# EAGLE design motor_driver (EAGLE 7.1.0)
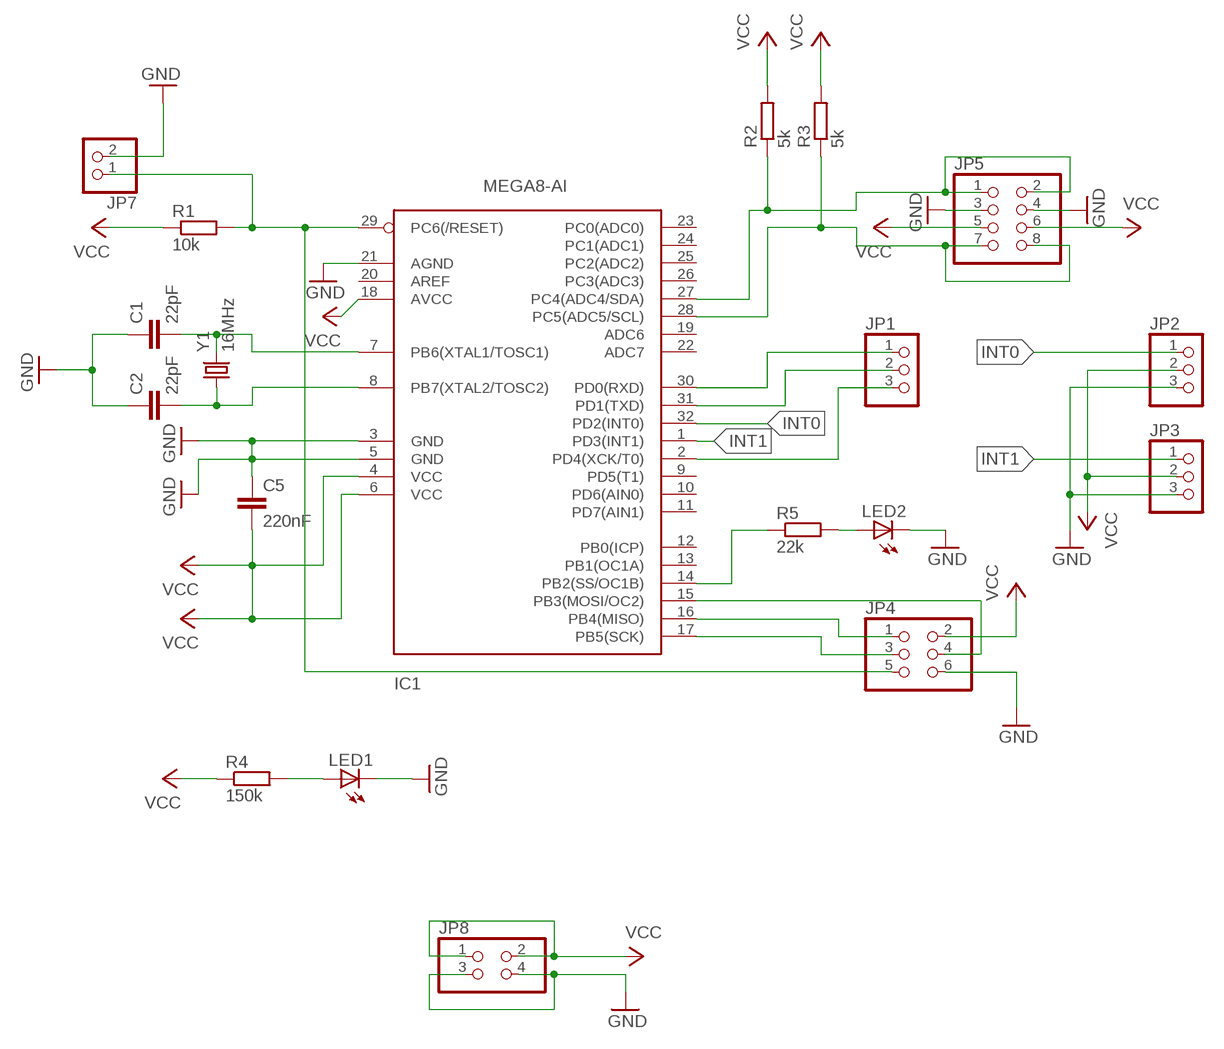
[diagram p0: schematic, sheet 1]

## Parts
C1  22pF  CAP1206  [1206]
C2  22pF  CAP1206  [1206]
C5  220nF  CAP0805  [0805]
IC1  MEGA8-AI  [TQFP32-08]
JP1  PINHD-1X3  [1X03]
JP2  PINHD-1X3  [1X03]
JP3  PINHD-1X3  [1X03]
JP4  PINHD-2X3  [2X03]
JP5  PINHD-2X4  [2X04]
JP7  PINHD-1X2  [1X02]
JP8  PINHD-2X2  [2X02]
LED1  LEDCHIPLED_0805  [CHIPLED_0805]
LED2  LEDCHIPLED_0805  [CHIPLED_0805]
R1  10k  RR1206  [R1206]
R2  5k  RR1206  [R1206]
R3  5k  RR1206  [R1206]
R4  150k  R  [R0805]
R5  22k  R  [R0805]
Y1  16MHz  CRYSTALSMD  [HC49UP]

## Nets
GND: C1.1 C2.1 C5.1 IC1.3(GND) IC1.5(GND) IC1.21(AGND) JP2.3 JP3.3 JP4.6 JP5.3 JP5.4 JP7.2 JP8.3 JP8.4 LED1.C LED2.C
INT0: IC1.32(PD2(INT0)) JP2.1
INT1: IC1.1(PD3(INT1)) JP3.1
N$1: IC1.31(PD1(TXD)) JP1.2
N$2: C2.2 IC1.8(PB7(XTAL2/TOSC2)) Y1.1
N$3: C1.2 IC1.7(PB6(XTAL1/TOSC1)) Y1.2
N$4: IC1.14(PB2(SS/OC1B)) R5.1
N$5: IC1.30(PD0(RXD)) JP1.1
N$6: IC1.2(PD4(XCK/T0)) JP1.3
N$7: IC1.15(PB3(MOSI/OC2)) JP4.4
N$9: IC1.28(PC5(ADC5/SCL)) JP5.7 JP5.8 R3.1
N$10: IC1.27(PC4(ADC4/SDA)) JP5.1 JP5.2 R2.1
N$11: LED1.A R4.2
N$12: IC1.17(PB5(SCK)) JP4.3
N$13: IC1.16(PB4(MISO)) JP4.1
N$14: LED2.A R5.2
RESET: IC1.29(PC6(/RESET)) JP4.5 JP7.1 R1.2
VCC: C5.2 IC1.4(VCC) IC1.6(VCC) IC1.18(AVCC) JP2.2 JP3.2 JP4.2 JP5.5 JP5.6 JP8.1 JP8.2 R1.1 R2.2 R3.2 R4.1
Unconnected: IC1.9(PD5(T1)) IC1.10(PD6(AIN0)) IC1.11(PD7(AIN1)) IC1.12(PB0(ICP)) IC1.13(PB1(OC1A)) IC1.19(ADC6) IC1.20(AREF) IC1.22(ADC7) IC1.23(PC0(ADC0)) IC1.24(PC1(ADC1)) IC1.25(PC2(ADC2)) IC1.26(PC3(ADC3))

## Library data of the parts
C1 C2 C5 = SparkFun-Capacitors:CAP: Capacitor Standard 0603 ceramic capacitor, and 0.1" leaded capacitor.
IC1 = avr-7:MEGA8: MICROCONTROLLER 8 Kbytes FLASH 1 kbytes SRAM 512 bytes EEPROM USART 6-channel 10 bit ADC 2-channel 8 bit ADC
JP1-JP3 = pinhead:PINHD-1X3: PIN HEADER
JP4 = pinhead:PINHD-2X3: PIN HEADER
JP5 = pinhead:PINHD-2X4: PIN HEADER
JP7 = pinhead:PINHD-1X2: PIN HEADER
JP8 = pinhead:PINHD-2X2: PIN HEADER
LED1 LED2 = adafruit:LED: LED OSRAM: - CHIPLED LG R971, LG N971, LY N971, LG Q971, LY Q971, LO R971, LY R971 LH N974, LH R974 LS Q976, LO Q976, LY Q976 LO Q996 - Hyper CHIPLED LW Q18S LB Q993, LB Q99A, LB R99A - SideLED LS A670, LO A670, LY A670, LG A670, LP A670 LB A673, LV A673, LT A673, LW A673 LH A674 LY A675 LS A676, LA A676, LO A676, LY A676, LW A676 LS A679, LY A679, LG A679 - Hyper Micro SIDELED® LS Y876, LA Y876, LO Y876, LY Y876 LT Y87S - SmartLED LW L88C, LW L88S LB L89C, LB L89S, LG L890 LS L89K, LO L89K, LY L89K LS L896, LA L896, LO L896, LY L896 - TOPLED LS T670, LO T670, LY T670, LG T670, LP T670 LSG T670, LSP T670, LSY T670, LOP T670, LYG T670 LG T671, LOG T671, LSG T671 LB T673, LV T673, LT T673, LW T673 LH T674 LS T676, LA T676, LO T676, LY T676, LB T676, LH T676, LSB T676, LW T676 LB T67C, LV T67C, LT T67C, LS T67K, LO T67K, LY T67K, LW E67C LS E67B, LA E67B, LO E67B, LY E67B, LB E67C, LV E67C, LT E67C LW T67C LS T679, LY T679, LG T679 LS T770, LO T770, LY T770, LG T770, LP T770 LB T773, LV T773, LT T773, LW T773 LH T774 LS E675, LA E675, LY E675, LS T675 LS T776, LA T776, LO T776, LY T776, LB T776 LHGB T686 LT T68C, LB T68C - Hyper Mini TOPLED® LB M676 - Mini TOPLED Santana® LG M470 LS M47K, LO M47K, LY M47K Source: http://www.osram.convergy.de/
R1-R5 = eagle-ltspice:R: RESISTOR, European symbol; SPICEMODEL: NONE; SPICEPREFIX: R
Y1 = SparkFun-FreqCtrl:CRYSTAL: Various standard crystals. Proven footprints.

## Board
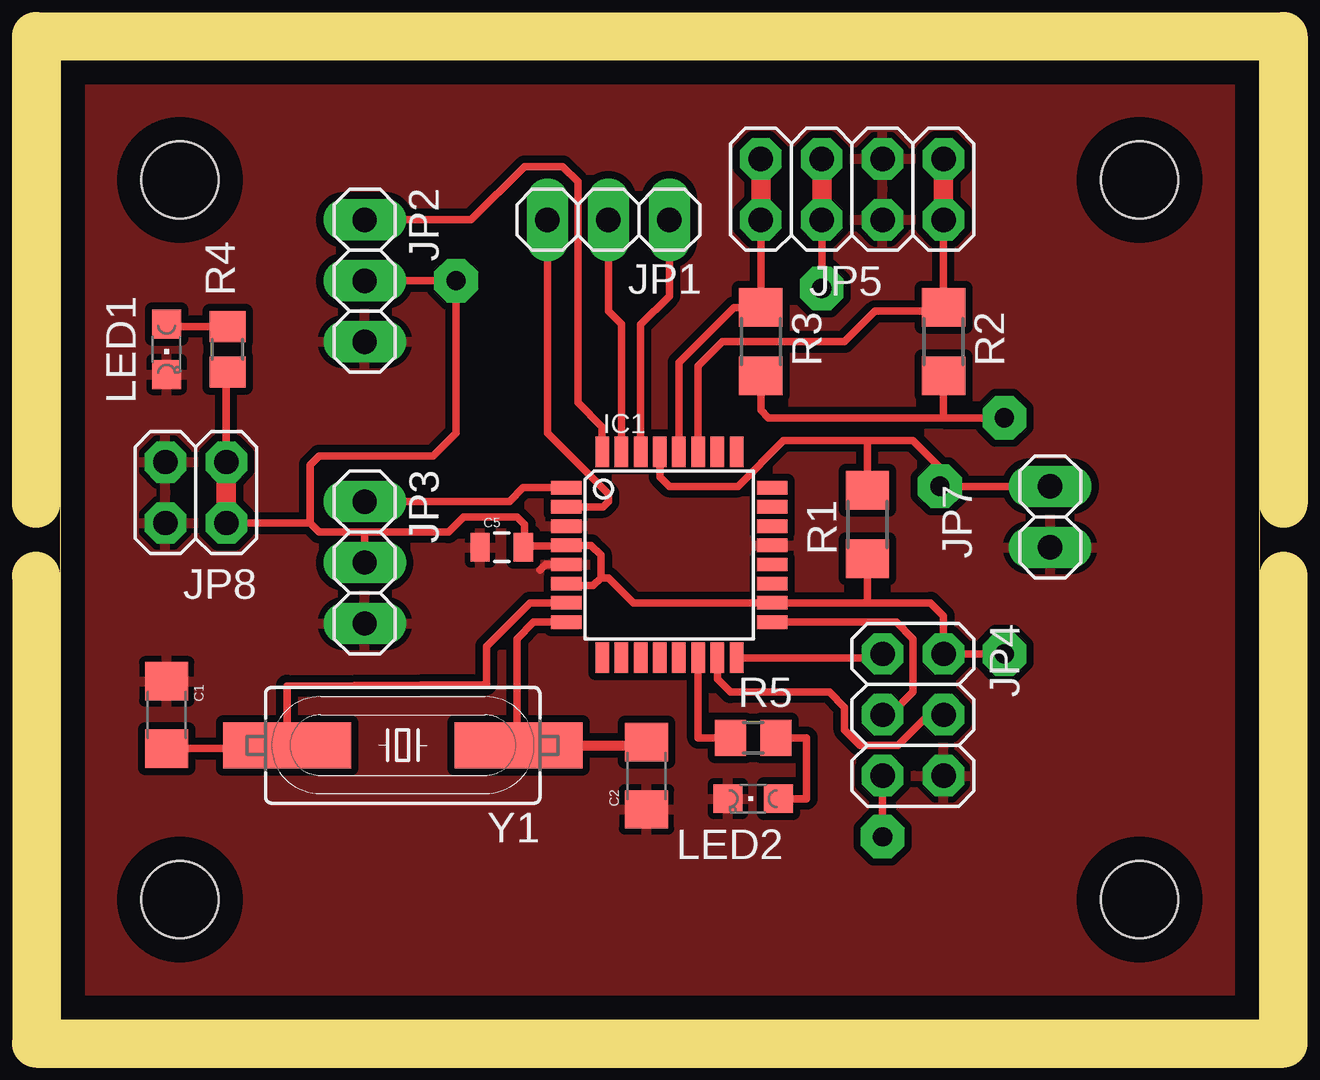
[diagram p1: board, top side]
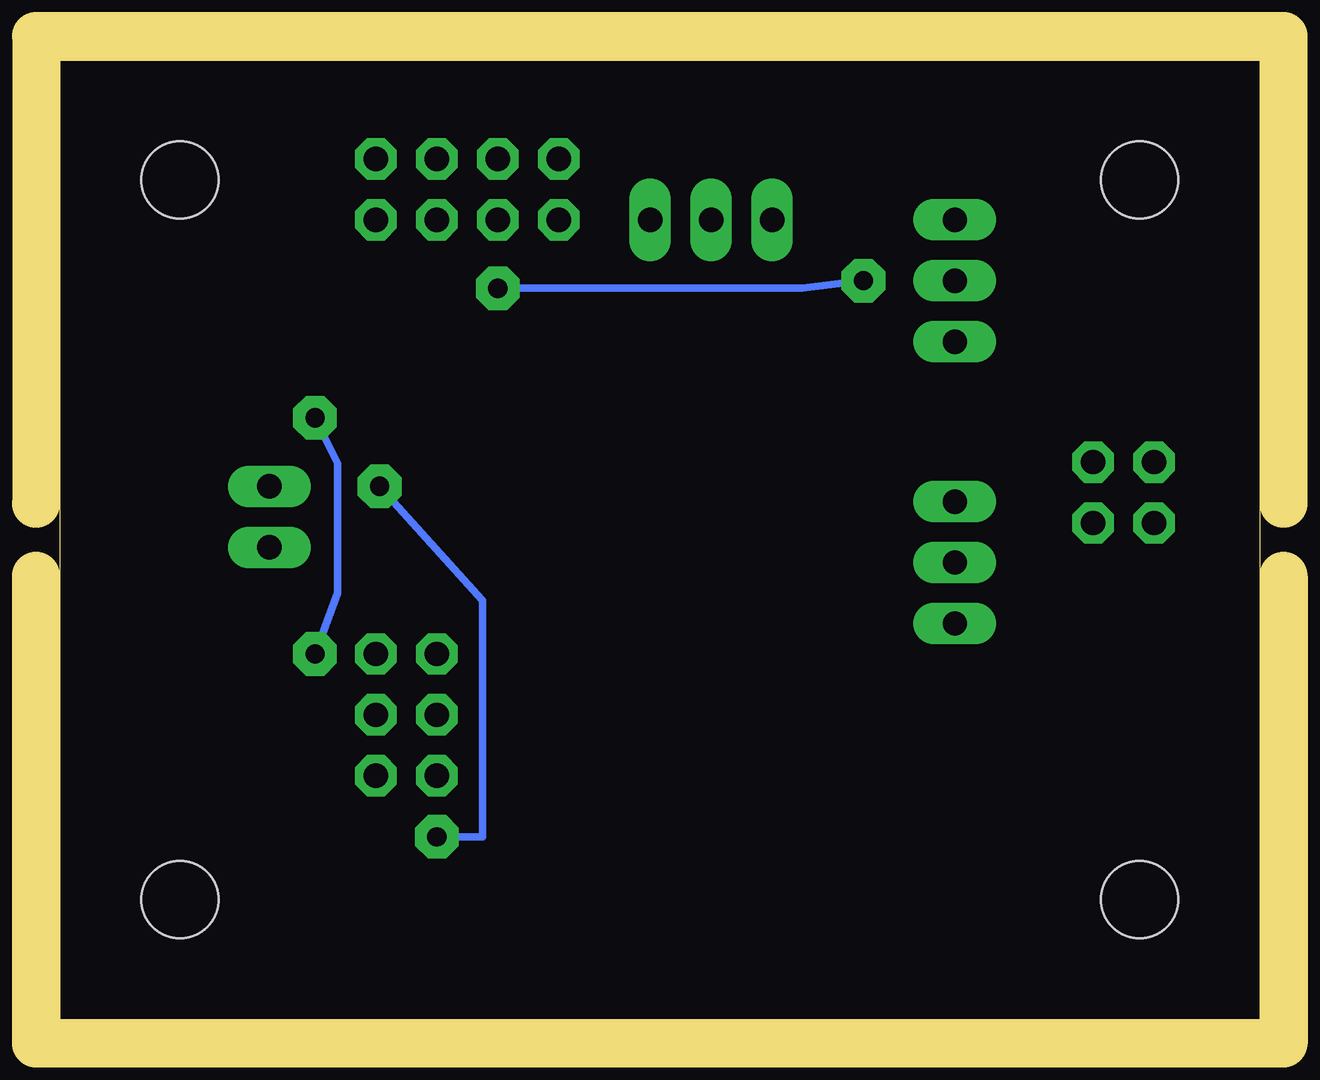
[diagram p2: board, bottom side, seen from below]

Size 50 x 40 mm. Coordinates in mm from the lower left corner, seen from the top.
Outline: 0,0 50,0 50,40 0,40 0,0
Copper layers (1*16): Top 0.035mm / dielectric 1.5mm / Bottom 0.035mm
Design rules "default *": minimum track width 10mil, minimum drill 24mil, track to track 12mil, track to pad 8mil, pad to pad 8mil, via to via 8mil, smd to smd 8mil, copper to edge 40mil, drill to drill 8mil, minimum pad ring 10mil, minimum via ring 8mil, stop-mask expansion 4mil, vias tented up to drill 0mil, thermal gap 10mil
Holes 3.2 mm at 5,35 5,5 45,5 45,35
Milling: 6 lines

### Footprints (pad centres in the part's own frame; a part is rotated, then mirrored left to right if it is on the bottom)
1206 = smd 1.6 x 1.8: 1 -1.4,0; 2 1.4,0
0805 = smd 0.8 x 1.2: 1 -0.9,0; 2 0.9,0
TQFP32-08 = smd 1.27 x 0.559: 1 -4.293,2.8; 2 -4.293,2; 3 -4.293,1.2; 4 -4.293,0.4; 5 -4.293,-0.4; 6 -4.293,-1.2; 7 -4.293,-2; 8 -4.293,-2.8; 17 4.293,-2.8; 18 4.293,-2; 19 4.293,-1.2; 20 4.293,-0.4; 21 4.293,0.4; 22 4.293,1.2; 23 4.293,2; 24 4.293,2.8 | smd 0.559 x 1.27: 9 -2.8,-4.293; 10 -2,-4.293; 11 -1.2,-4.293; 12 -0.4,-4.293; 13 0.4,-4.293; 14 1.2,-4.293; 15 2,-4.293; 16 2.8,-4.293; 25 2.8,4.293; 26 2,4.293; 27 1.2,4.293; 28 0.4,4.293; 29 -0.4,4.293; 30 -1.2,4.293; 31 -2,4.293; 32 -2.8,4.293
1X03 = drill 1.016 long: 1 -2.54,0; 2 0,0; 3 2.54,0
2X03 = drill 1.016 octagon: 1 -2.54,-1.27; 2 -2.54,1.27; 3 0,-1.27; 4 0,1.27; 5 2.54,-1.27; 6 2.54,1.27
2X04 = drill 1.016 octagon: 1 -3.81,-1.27; 2 -3.81,1.27; 3 -1.27,-1.27; 4 -1.27,1.27; 5 1.27,-1.27; 6 1.27,1.27; 7 3.81,-1.27; 8 3.81,1.27
1X02 = drill 1.016 long: 1 -1.27,0; 2 1.27,0
2X02 = drill 1.016 octagon: 1 -1.27,-1.27; 2 -1.27,1.27; 3 1.27,-1.27; 4 1.27,1.27
CHIPLED_0805 = smd 1.2 x 1.2: A 0,-1.05; C 0,1.05
R1206 = smd 1.6 x 1.803: 1 -1.422,0; 2 1.422,0
R0805 = smd 1.3 x 1.5: 1 -0.95,0; 2 0.95,0
HC49UP = smd 5.334 x 1.93: 1 -4.826,0; 2 4.826,0

### Placement (x,y rotation side)
C1  4.45,12.7 270 top
C2  24.45,10.16 90 top
C5  18.41,19.68 0 top
IC1  25.4,19.37 0 top
JP1  22.86,33.34 180 top
JP2  12.7,30.8 270 top
JP3  12.7,19.05 270 top
JP4  35.56,12.7 270 top
JP5  33.02,34.61 180 top
JP7  41.27,20.95 270 top
JP8  5.67,21.97 180 top
LED1  4.45,27.94 180 top
LED2  28.89,9.21 90 top
R1  33.66,20.64 90 top
R2  36.83,28.26 270 top
R3  29.21,28.26 270 top
R4  6.99,27.94 90 top
R5  28.89,11.75 0 top
Y1  14.29,11.43 180 top

### Tracks (layer width: path | path; a pad name or v marks a point on that pad's centre or on a via)
GND
  Top 0.305: IC1.5 20.24,18.97 20,18.73
  pour Top: -3.49,-2.86 -3.81,41.91 53.34,41.91 53.34,-2.86
INT0
  Top 0.305: IC1.32 22.6,24.71 21.59,25.72 21.59,34.92 20.95,35.56 19.37,35.56 17.14,33.34 JP2.1
INT1
  Top 0.305: IC1.1 19.31,22.17 18.73,21.59 JP3.1
N$1
  Top 0.305: IC1.31 23.4,28.99 22.86,29.53 JP1.2
N$2
  Top 0.305: IC1.8 19.74,16.57 19.05,15.88 19.05,11.49 Y1.1 19.68,11.43
  Top 0.406: 19.68,11.43 24.45,11.43 C2.2
N$3
  Top 0.305: C1.2 11.62,11.3 Y1.2 9.46,13.91 17.78,13.97 17.78,15.56 19.59,17.37 IC1.7
N$4
  Top 0.305: R5.1 26.6,11.75 IC1.14
N$5
  Top 0.305: IC1.30 24.2,28.96 25.4,30.16 JP1.1
N$6
  Top 0.305: IC1.2 22.64,21.37 22.86,21.59 22.86,21.91 20.32,24.45 JP1.3
N$7
  Top 0.305: JP4.4 36.2,12.7 34.92,11.43 33.34,11.43 32.7,12.06 32.7,13.02 32.07,13.65 27.94,13.65 27.4,14.19 IC1.15
N$9
  Top 0.305: IC1.28 25.8,27.39 28.09,29.68 R3.1 JP5.8
  Top 0.813: JP5.7 JP5.8
N$10
  Top 0.305: IC1.27 26.6,27.23 27.62,28.26 32.7,28.26 33.97,29.53 36.2,29.53 36.35,29.68 R2.1 JP5.2
  Top 0.813: JP5.1 JP5.2
N$11
  Top 0.305: R4.2 4.54,28.89 LED1.A
N$12
  Top 0.305: 34.61,12.7 35.56,13.65 35.56,15.88 34.87,16.57 IC1.17
  Top 0.406: JP4.3 34.61,12.7
N$13
  Top 0.305: IC1.16 34.29,15.07
  Top 0.406: 34.29,15.07 JP4.1
N$14
  Top 0.305: R5.2 31.11,11.75 31.11,9.21 LED2.A
RESET  (via drill 0.8)
  Top 0.305: IC1.29 25,22.62 25.4,22.23 28.26,22.23 30.16,24.13 33.66,24.13 | JP7.1 v36.68,22.23 36.68,23.01 35.56,24.13 33.66,24.13 | JP4.5 v34.29,7.62 | R1.2 33.66,24.13
  Bottom 0.305: v34.29,7.62 32.38,7.62 32.38,17.46 v36.68,22.23
VCC  (via drill 0.8)
  Top 0.305: 34.14,19.37 R1.1 33.66,17.37 | 22.54,18.41 22.86,18.41 23.91,17.37 IC1.18 33.66,17.37 | 22.54,18.41 22.23,18.1 21.18,18.1 IC1.6 | 22.54,18.41 22.54,19.37 22.14,19.77 IC1.4 21.08,19.74 19.37,19.74 | 12.7,20.32 16.19,20.32 16.83,20.95 19.05,20.95 19.37,20.64 19.37,19.74 | 19.37,19.74 C5.2 | JP3.2 12.7,20.32 | 12.7,20.32 10.79,20.32 10.42,20.7 | 36.83,25.08 v39.37,25.08 | JP8.2 10.42,20.7 | R2.2 36.83,25.08 | 36.83,25.08 29.53,25.08 29.21,25.4 R3.2 | JP8.1 6.93,26.62 R4.1 | 10.42,20.7 10.42,23.12 10.79,23.5 15.56,23.5 16.51,24.45 v16.51,30.8 JP2.2 | JP5.6 v31.75,30.48 | v39.37,15.24 JP4.2 36.83,16.83 36.29,17.37 33.66,17.37
  Top 0.813: JP8.1 JP8.2 | JP5.5 JP5.6
  Bottom 0.305: v39.37,15.24 38.42,17.78 38.42,23.18 v39.37,25.08 | v31.75,30.48 19.05,30.48 v16.51,30.8